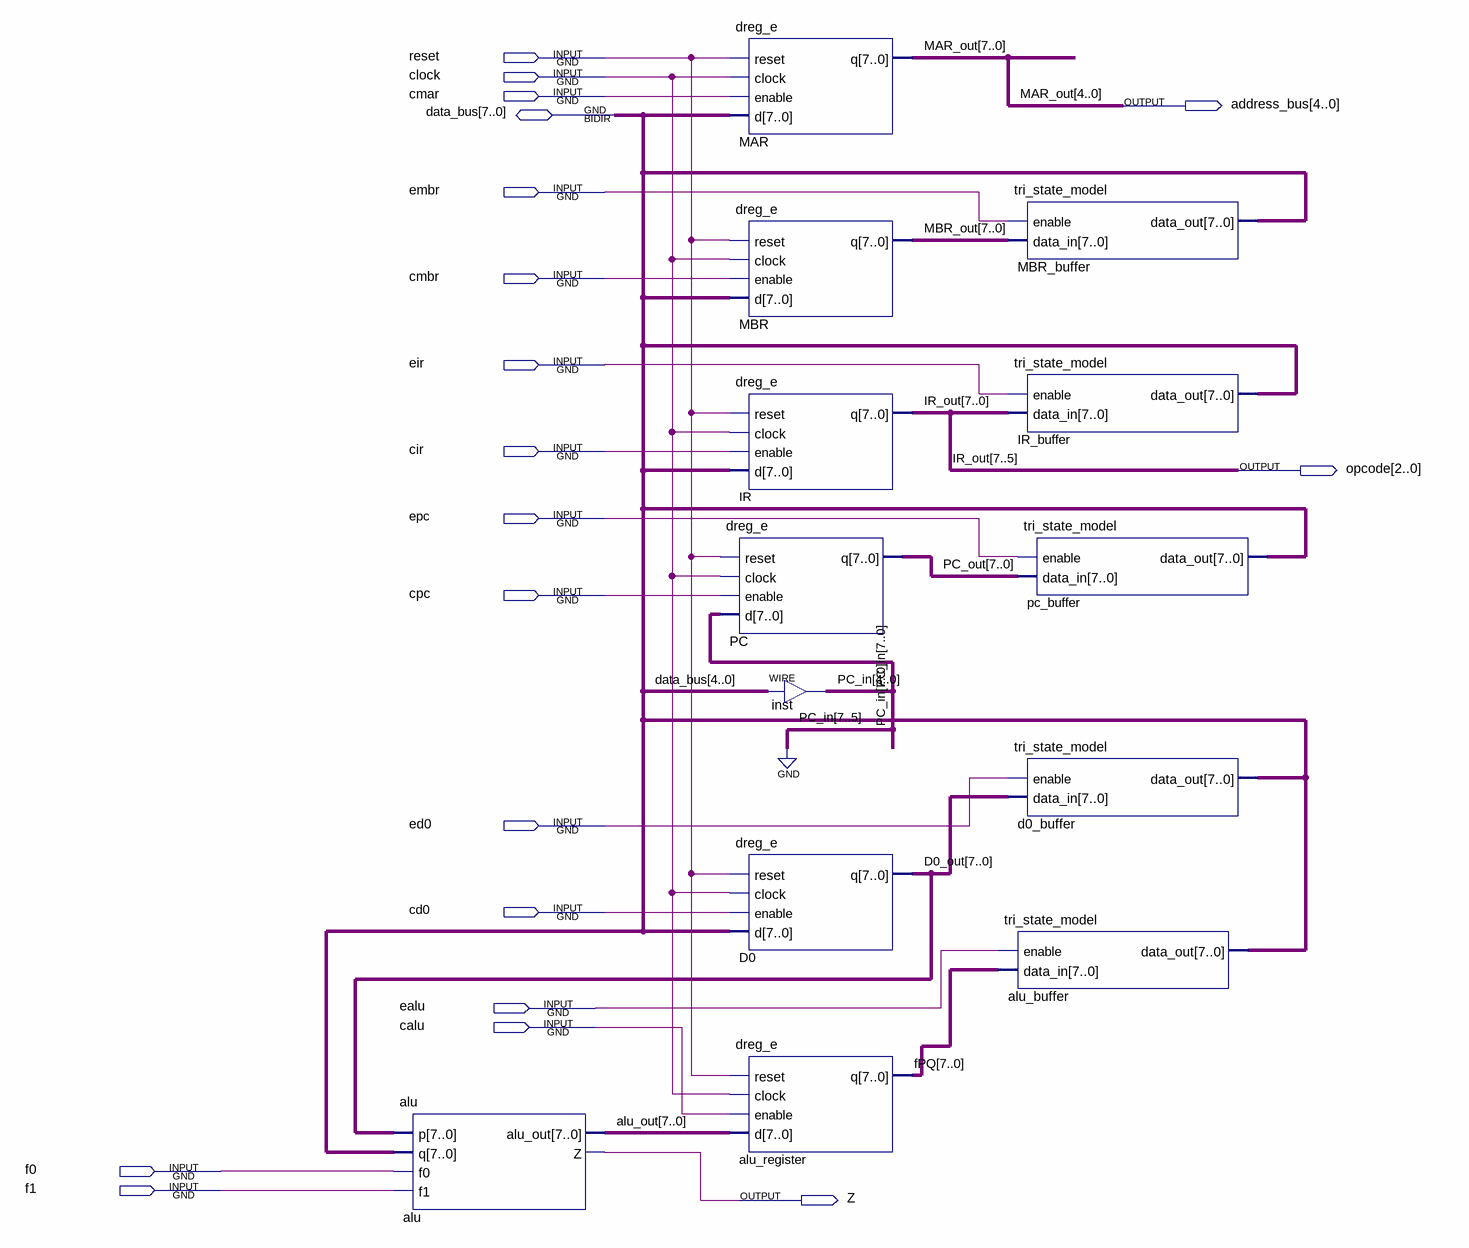
[diagram p0: schematic sheet]
// Quartus schematic Datapath.bdf as structural Verilog: 13 symbols, 19 pins
module Datapath (
  input  reset,
  input  clock,
  input  cmar,
  input  embr,
  input  cmbr,
  input  eir,
  input  cir,
  input  epc,
  input  cpc,
  input  ed0,
  input  cd0,
  input  ealu,
  input  calu,
  input  f0,
  input  f1,
  inout  [7:0] data_bus,
  output [4:0] address_bus,
  output [2:0] opcode,
  output Z
);

  wire [4:0] IR_out, PC_in;
  wire [7:0] alu_out, D0_out, fPQ, MBR_out, PC_out;
  wire [7:5] MAR_out;

  alu alu (.p(D0_out), .q(data_bus), .f0(f0), .f1(f1), .alu_out(alu_out), .Z(Z));
  dreg_e MAR (.reset(reset), .clock(clock), .enable(cmar), .d(data_bus), .q({MAR_out, address_bus}));
  dreg_e MBR (.reset(reset), .clock(clock), .enable(cmbr), .d(data_bus), .q(MBR_out));
  dreg_e IR (.reset(reset), .clock(clock), .enable(cir), .d(data_bus), .q({opcode, IR_out}));
  dreg_e PC (.reset(reset), .clock(clock), .enable(cpc), .d({3'b000, PC_in}), .q(PC_out));
  dreg_e D0 (.reset(reset), .clock(clock), .enable(cd0), .d(data_bus), .q(D0_out));
  dreg_e alu_register (.reset(reset), .clock(clock), .enable(calu), .d(alu_out), .q(fPQ));
  assign PC_in = data_bus[4:0];  // WIRE inst
  tri_state_model MBR_buffer (.enable(embr), .data_in(MBR_out), .data_out(data_bus));
  tri_state_model IR_buffer (.enable(eir), .data_in({opcode, IR_out}), .data_out(data_bus));
  tri_state_model pc_buffer (.enable(epc), .data_in(PC_out), .data_out(data_bus));
  tri_state_model d0_buffer (.enable(ed0), .data_in(D0_out), .data_out(data_bus));
  tri_state_model alu_buffer (.enable(ealu), .data_in(fPQ), .data_out(data_bus));

  // Other names for the same wires on the sheet: IR_out[7:5] = opcode; MAR_out[4:0] = address_bus
endmodule
